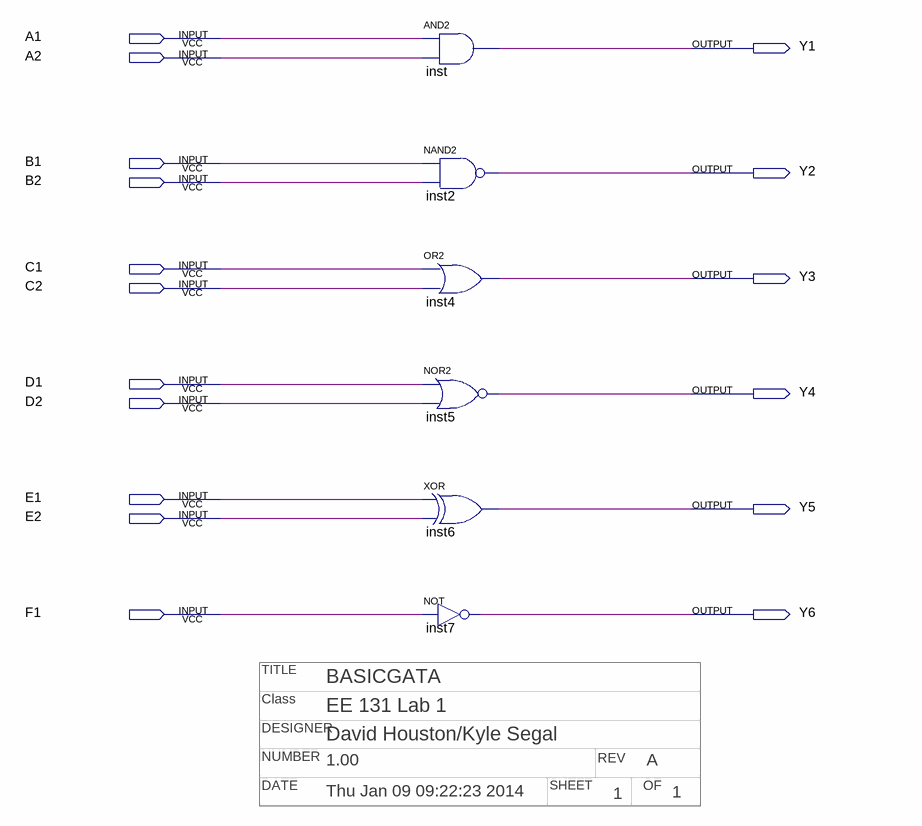
[diagram p0: schematic sheet]
// Quartus schematic BasicGata.bdf as structural Verilog: 6 symbols, 17 pins
// Title block: TITLE: BASICGATA; Class: EE 131 Lab 1; DESIGNER: David Houston/Kyle Segal; NUMBER: 1.00; REV: A; DATE: Thu Jan 09 09:22:23 2014; SHEET: 1; OF: 1
module BasicGata (
  input  A1,
  input  A2,
  input  B1,
  input  B2,
  input  C1,
  input  C2,
  input  D1,
  input  D2,
  input  E1,
  input  E2,
  input  F1,
  output Y1,
  output Y2,
  output Y3,
  output Y4,
  output Y5,
  output Y6
);

  and inst (Y1, A1, A2);
  nand inst2 (Y2, B1, B2);
  or inst4 (Y3, C1, C2);
  nor inst5 (Y4, D1, D2);
  xor inst6 (Y5, E1, E2);
  not inst7 (Y6, F1);
endmodule
